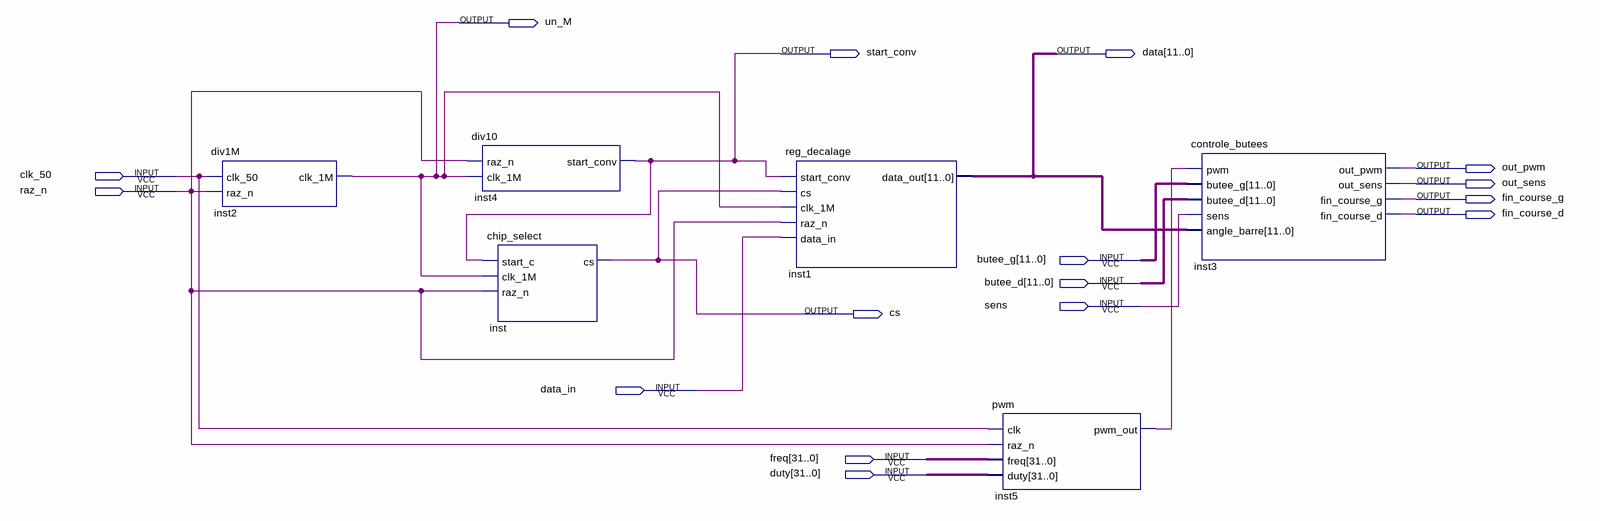
[diagram p0: schematic sheet]
// Quartus schematic mcp.bdf as structural Verilog: 6 symbols, 16 pins
module mcp (
  input  clk_50,
  input  raz_n,
  input  [11:0] butee_g,
  input  [11:0] butee_d,
  input  sens,
  input  data_in,
  input  [31:0] freq,
  input  [31:0] duty,
  output un_M,
  output start_conv,
  output [11:0] data,
  output out_pwm,
  output out_sens,
  output fin_course_g,
  output fin_course_d,
  output cs
);

  wire inst5_pwm_out;

  div1M inst2 (.clk_50(clk_50), .raz_n(raz_n), .clk_1M(un_M));
  div10 inst4 (.raz_n(raz_n), .clk_1M(un_M), .start_conv(start_conv));
  chip_select inst (.start_c(start_conv), .clk_1M(un_M), .raz_n(raz_n), .cs(cs));
  reg_decalage inst1 (
    .start_conv(start_conv), .cs(cs), .clk_1M(un_M), .raz_n(raz_n), .data_in(data_in), .data_out(data));
  pwm inst5 (.clk(clk_50), .raz_n(raz_n), .freq(freq), .duty(duty), .pwm_out(inst5_pwm_out));
  controle_butees inst3 (
    .pwm(inst5_pwm_out), .butee_g(butee_g), .butee_d(butee_d), .sens(sens), .angle_barre(data),
    .out_pwm(out_pwm), .out_sens(out_sens), .fin_course_g(fin_course_g), .fin_course_d(fin_course_d));
endmodule
